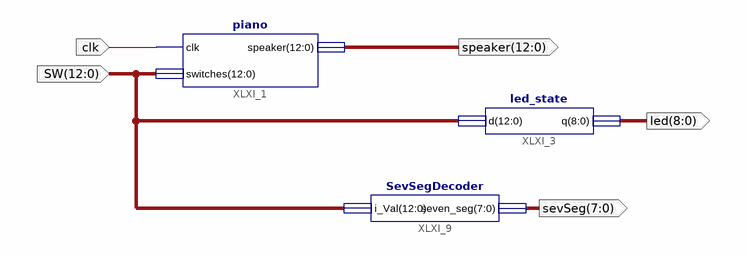
[diagram p0: schematic sheet 1]
// Xilinx ISE schematic top.sch (spartan6) as structural Verilog: 3 symbols, 5 ports
module top (
  input  clk,
  input  [12:0] SW,
  output [12:0] speaker,
  output [7:0] sevSeg,
  output [8:0] led
);

  piano XLXI_1 (.clk(clk), .switches(SW), .speaker(speaker));
  led_state XLXI_3 (.d(SW), .q(led));
  SevSegDecoder XLXI_9 (.i_Val(SW), .seven_seg(sevSeg));
endmodule
